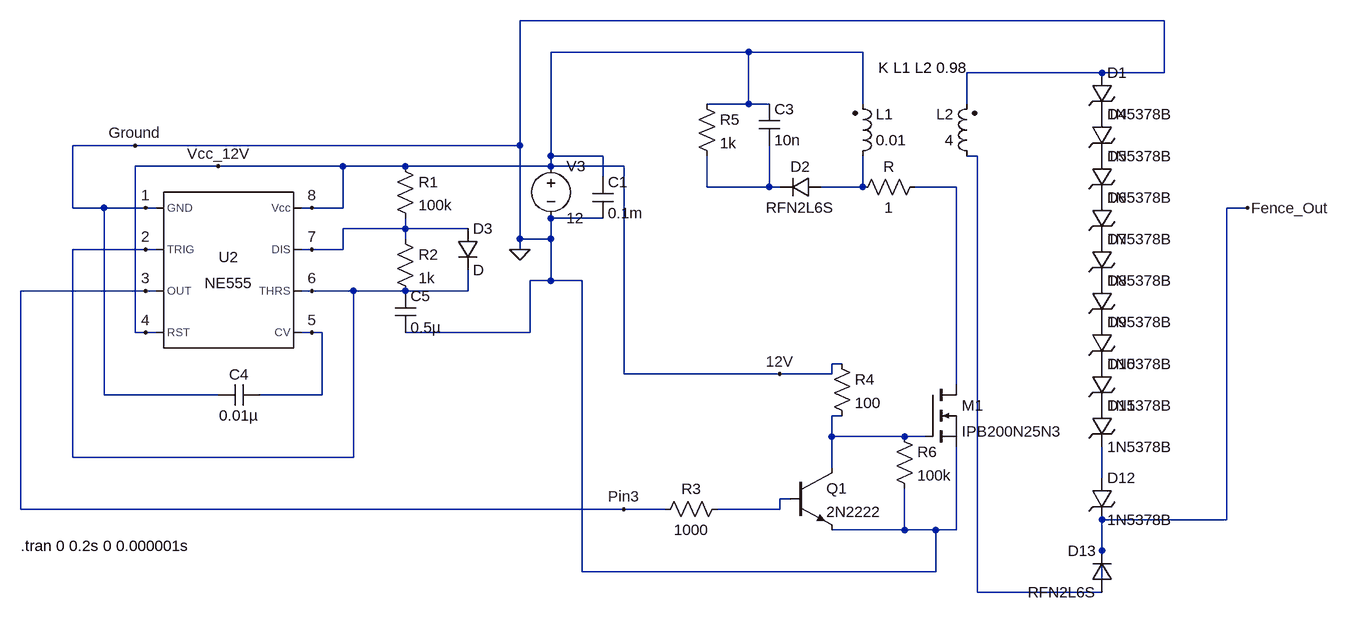
[diagram p0: schematic our.asc]
our.asc, the LTspice schematic file:
Version 4
SHEET 1 1740 1204
WIRE 1472 -304 480 -304
WIRE 832 -256 528 -256
WIRE 1008 -256 832 -256
WIRE 1376 -224 1168 -224
WIRE 1472 -224 1472 -304
WIRE 1472 -224 1376 -224
WIRE 832 -176 832 -256
WIRE 832 -176 768 -176
WIRE 864 -176 832 -176
WIRE 1008 -176 1008 -256
WIRE 1168 -176 1168 -224
WIRE -112 -112 -208 -112
WIRE 480 -112 480 -304
WIRE 480 -112 -112 -112
WIRE 528 -96 528 -256
WIRE 608 -96 528 -96
WIRE 1184 -96 1168 -96
WIRE 16 -80 -112 -80
WIRE 208 -80 16 -80
WIRE 304 -80 208 -80
WIRE 528 -80 528 -96
WIRE 528 -80 304 -80
WIRE 640 -80 528 -80
WIRE 608 -64 608 -96
WIRE 768 -48 768 -96
WIRE 864 -48 864 -112
WIRE 864 -48 768 -48
WIRE 880 -48 864 -48
WIRE 1008 -48 1008 -96
WIRE 1008 -48 944 -48
WIRE 1152 -48 1088 -48
WIRE -208 -16 -208 -112
WIRE -160 -16 -208 -16
WIRE -96 -16 -160 -16
WIRE -80 -16 -96 -16
WIRE 160 -16 144 -16
WIRE 208 -16 208 -80
WIRE 208 -16 160 -16
WIRE 1600 -16 1568 -16
WIRE 608 0 528 0
WIRE 304 16 304 0
WIRE 304 16 208 16
WIRE 400 16 304 16
WIRE 304 32 304 16
WIRE 480 32 480 -112
WIRE 528 32 528 0
WIRE 528 32 480 32
WIRE -96 48 -208 48
WIRE -80 48 -96 48
WIRE 160 48 144 48
WIRE 208 48 208 16
WIRE 208 48 160 48
WIRE 480 48 480 32
WIRE 528 96 528 32
WIRE 528 96 496 96
WIRE 576 96 528 96
WIRE -96 112 -288 112
WIRE -80 112 -96 112
WIRE 160 112 144 112
WIRE 224 112 160 112
WIRE 304 112 224 112
WIRE 400 112 400 80
WIRE 400 112 304 112
WIRE -112 176 -112 -80
WIRE -96 176 -112 176
WIRE -80 176 -96 176
WIRE 160 176 144 176
WIRE 176 176 160 176
WIRE 496 176 496 96
WIRE 496 176 304 176
WIRE 976 224 960 224
WIRE 640 240 640 -80
WIRE 880 240 640 240
WIRE 960 240 960 224
WIRE 960 240 880 240
WIRE 1152 256 1152 -48
WIRE -160 272 -160 -16
WIRE 16 272 -160 272
WIRE 176 272 176 176
WIRE 176 272 80 272
WIRE 976 304 960 304
WIRE 960 336 960 304
WIRE 1072 336 960 336
WIRE 1104 336 1072 336
WIRE -208 368 -208 48
WIRE 224 368 224 112
WIRE 224 368 -208 368
WIRE 960 384 960 336
WIRE 1376 400 1376 352
WIRE 896 432 880 432
WIRE -288 448 -288 112
WIRE 640 448 -288 448
WIRE 704 448 640 448
WIRE 880 448 880 432
WIRE 880 448 784 448
WIRE 1568 464 1568 -16
WIRE 1568 464 1376 464
WIRE 1072 480 1072 416
WIRE 1072 480 960 480
WIRE 1120 480 1072 480
WIRE 1152 480 1152 352
WIRE 1152 480 1120 480
WIRE 1376 512 1376 464
WIRE 576 544 576 96
WIRE 1120 544 1120 480
WIRE 1120 544 576 544
WIRE 1376 560 1376 512
WIRE 1184 576 1184 -96
WIRE 1376 576 1184 576
FLAG 480 48 0
FLAG 1600 -16 Fence_Out
FLAG -96 -16 1
FLAG -96 48 2
FLAG -96 112 3
FLAG -96 176 4
FLAG 160 176 5
FLAG 160 112 6
FLAG 160 48 7
FLAG 160 -16 8
FLAG -112 -112 Ground
FLAG 16 -80 Vcc_12V
FLAG 880 240 12V
FLAG 640 448 Pin3
SYMBOL npn 896 384 R0
SYMATTR InstName Q1
SYMATTR Value 2N2222
SYMBOL res 800 432 R90
WINDOW 0 0 56 VBottom 2
WINDOW 3 32 56 VTop 2
SYMATTR InstName R3
SYMATTR Value 1000
SYMBOL res 960 208 R0
SYMATTR InstName R4
SYMATTR Value 100
SYMBOL nmos 1104 256 R0
SYMATTR InstName M1
SYMATTR Value IPB200N25N3
SYMBOL res 1056 320 R0
SYMATTR InstName R6
SYMATTR Value 100k
SYMBOL diode 944 -64 R90
WINDOW 0 0 32 VBottom 2
WINDOW 3 32 32 VTop 2
SYMATTR InstName D2
SYMATTR Value RFN2L6S
SYMBOL ind2 992 -80 M180
WINDOW 0 36 80 Left 2
WINDOW 3 36 40 Left 2
SYMATTR InstName L1
SYMATTR Value 0.01
SYMATTR Type ind
SYMBOL ind2 1184 -80 R180
WINDOW 0 36 80 Left 2
WINDOW 3 36 40 Left 2
SYMATTR InstName L2
SYMATTR Value 4
SYMATTR Type ind
SYMBOL res 752 -192 R0
SYMATTR InstName R5
SYMATTR Value 1k
SYMBOL cap 848 -176 R0
SYMATTR InstName C3
SYMATTR Value 10n
SYMBOL Misc\\NE555 32 80 R0
SYMATTR InstName U2
SYMBOL cap 80 256 R90
WINDOW 0 0 32 VBottom 2
WINDOW 3 32 32 VTop 2
SYMATTR InstName C4
SYMATTR Value 0.01µ
SYMBOL res 288 -96 R0
SYMATTR InstName R1
SYMATTR Value 100k
SYMBOL res 288 16 R0
SYMATTR InstName R2
SYMATTR Value 1k
SYMBOL cap 288 112 R0
SYMATTR InstName C5
SYMATTR Value 0.5µ
SYMBOL voltage 528 -96 R0
WINDOW 123 0 0 Left 0
WINDOW 39 0 0 Left 0
SYMATTR InstName V3
SYMATTR Value 12
SYMBOL diode 384 16 R0
SYMATTR InstName D3
SYMBOL zener 1360 -224 R0
SYMATTR InstName D1
SYMATTR Value 1N5378B
SYMBOL zener 1360 -160 R0
SYMATTR InstName D4
SYMATTR Value 1N5378B
SYMBOL zener 1360 -96 R0
SYMATTR InstName D5
SYMATTR Value 1N5378B
SYMBOL zener 1360 -32 R0
SYMATTR InstName D6
SYMATTR Value 1N5378B
SYMBOL zener 1360 32 R0
SYMATTR InstName D7
SYMATTR Value 1N5378B
SYMBOL zener 1360 96 R0
SYMATTR InstName D8
SYMATTR Value 1N5378B
SYMBOL zener 1360 160 R0
SYMATTR InstName D9
SYMATTR Value 1N5378B
SYMBOL zener 1360 224 R0
SYMATTR InstName D10
SYMATTR Value 1N5378B
SYMBOL zener 1360 288 R0
SYMATTR InstName D11
SYMATTR Value 1N5378B
SYMBOL zener 1360 400 R0
SYMATTR InstName D12
SYMATTR Value 1N5378B
SYMBOL res 1104 -64 R90
WINDOW 0 0 56 VBottom 2
WINDOW 3 32 56 VTop 2
SYMATTR InstName R
SYMATTR Value 1
SYMBOL diode 1392 576 R180
WINDOW 0 24 64 Left 2
WINDOW 3 24 0 Left 2
SYMATTR InstName D13
SYMATTR Value RFN2L6S
SYMBOL cap 592 -64 R0
SYMATTR InstName C1
SYMATTR Value 0.1m
TEXT 1032 -232 Left 2 !K L1 L2 0.98
TEXT -288 504 Left 2 !.tran 0 0.2s 0 0.000001s

The netlist it stands for:
* our.asc
Q1 N005 N007 0 0 2N2222
R3 N007 Pin3 1000
R4 12V N005 100
M1 N004 N005 0 0 IPB200N25N3
R6 N005 0 100k
D2 N003 N002 RFN2L6S
L1 N003 12V 0.01
L2 N001 0 4
R5 12V N002 1k
C3 12V N002 10n
XU2 0 6 Pin3 12V 5 6 7 12V NE555  ; pins GND TRIG OUT RST CV THRS DIS Vcc
C4 5 0 0.01µ
R1 12V 7 100k
R2 7 6 1k
C5 6 0 0.5µ
V3 12V 0 12
D3 7 6 D
D1 0 P001 1N5378B
D4 P001 P002 1N5378B
D5 P002 P003 1N5378B
D6 P003 P004 1N5378B
D7 P004 P005 1N5378B
D8 P005 P006 1N5378B
D9 P006 P007 1N5378B
D10 P007 P008 1N5378B
D11 P008 N006 1N5378B
D12 N006 Fence_Out 1N5378B
R N004 N003 1
D13 N001 Fence_Out RFN2L6S
C1 12V 0 0.1m
.model D D
.lib standard.dio
.model NPN NPN
.model PNP PNP
.lib standard.bjt
.model NMOS NMOS
.model PMOS PMOS
.lib standard.mos
K L1 L2 0.98
.tran 0 0.2s 0 0.000001s
.lib NE555.sub
.backanno
.end